# EAGLE schematic dpad (EAGLE 6.6.0)
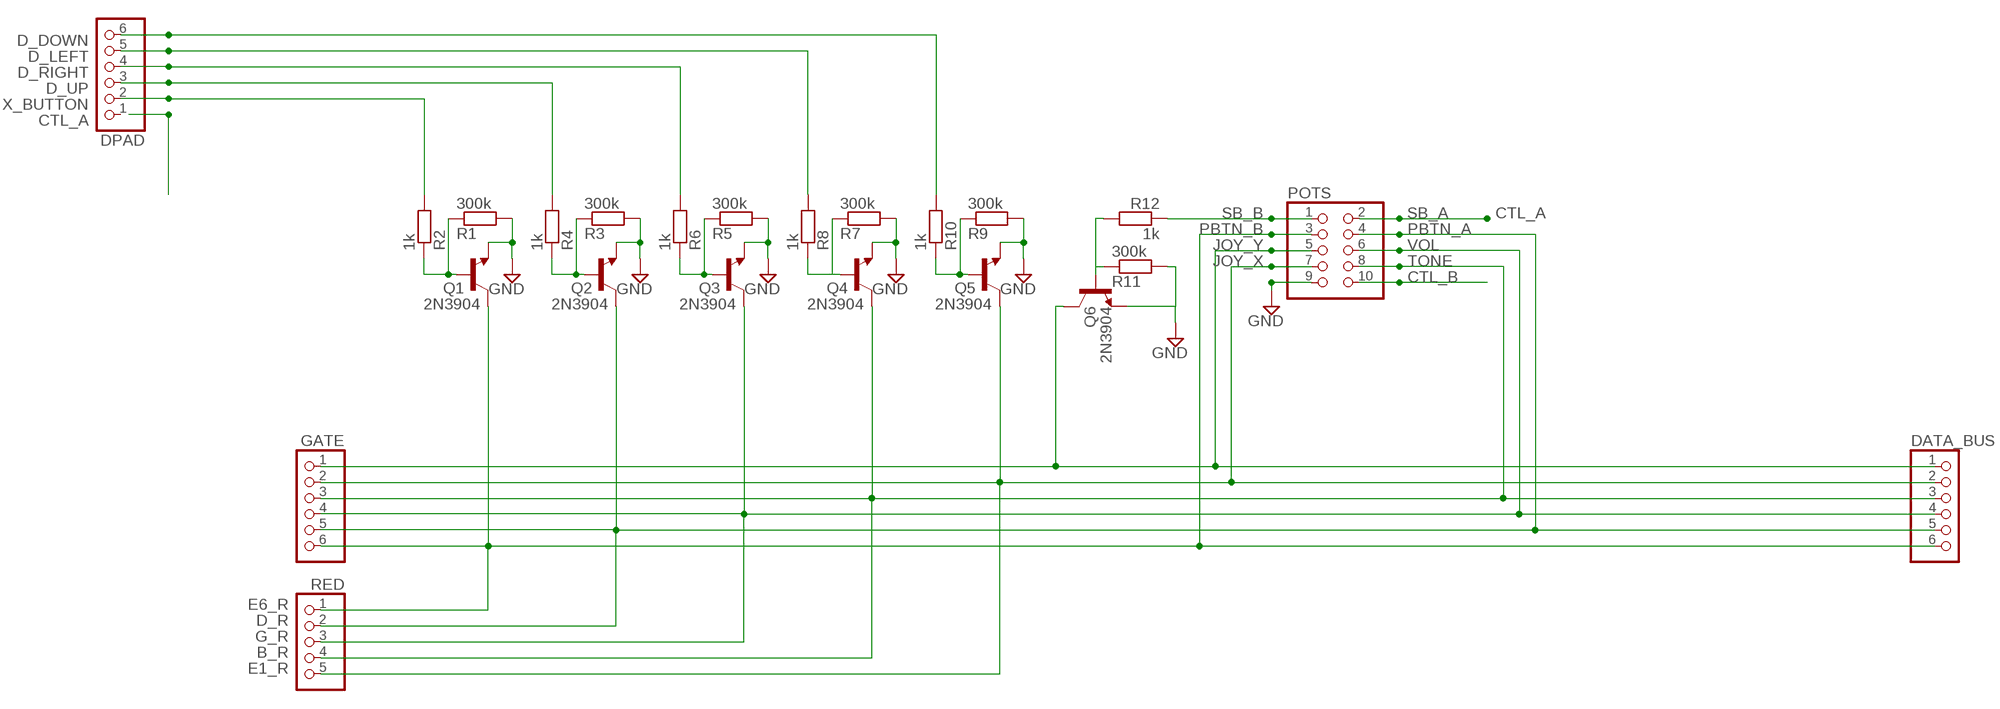
[diagram p0: schematic, sheet 1]

## Parts
DATA_BUS  PINHD-1X6  [1X06]
DPAD  PINHD-1X6  [1X06]
GATE  PINHD-1X6  [1X06]
POTS  PINHD-2X5  [2X05]
Q1  2N3904  [TO92-]
Q2  2N3904  [TO92-]
Q3  2N3904  [TO92-]
Q4  2N3904  [TO92-]
Q5  2N3904  [TO92-]
Q6  2N3904  [TO92-]
R1  300k  6MM-EU1  [R0207/1V]
R2  1k  6MM-EU1  [R0207/1V]
R3  300k  6MM-EU1  [R0207/1V]
R4  1k  6MM-EU1  [R0207/1V]
R5  300k  6MM-EU1  [R0207/1V]
R6  1k  6MM-EU1  [R0207/1V]
R7  300k  6MM-EU1  [R0207/1V]
R8  1k  6MM-EU1  [R0207/1V]
R9  300k  6MM-EU1  [R0207/1V]
R10  1k  6MM-EU1  [R0207/1V]
R11  300k  6MM-EU1  [R0207/1V]
R12  1k  6MM-EU1  [R0207/1V]
RED  PINHD-1X5  [1X05]

## Nets
CTL_A: POTS.2
D_DOWN: DPAD.6 R10.2
D_LEFT: DPAD.5 R8.2
D_RIGHT: DPAD.4 R6.2
D_UP: DPAD.3 R4.2
GND: POTS.9 Q1.3(E) Q2.3(E) Q3.3(E) Q4.3(E) Q5.3(E) Q6.3(E) R1.2 R3.2 R5.2 R7.2 R9.2 R11.2
N$1: Q2.2(B) R3.1 R4.1
N$2: Q3.2(B) R5.1 R6.1
N$3: Q4.2(B) R7.1 R8.1
N$4: Q5.2(B) R9.1 R10.1
N$5: Q6.2(B) R11.1 R12.2
N$6: POTS.10
N$7: DATA_BUS.3 GATE.3 POTS.8 Q4.1(C) RED.4
N$8: Q1.2(B) R1.1 R2.1
N$9: DATA_BUS.4 GATE.4 POTS.6 Q3.1(C) RED.3
N$10: DATA_BUS.5 GATE.5 POTS.4 Q2.1(C) RED.2
N$14: DATA_BUS.6 GATE.6 POTS.3 Q1.1(C) RED.1
N$17: DATA_BUS.1 GATE.1 POTS.5 Q6.1(C)
N$18: DATA_BUS.2 GATE.2 POTS.7 Q5.1(C) RED.5
SB_2: POTS.1 R12.1
X_BUTTON: DPAD.2 R2.2
Unconnected: DPAD.1

## Notes on the sheet
- CTL_A
- SB_B | SB_A
- PBTN_B | PBTN_A
- JOY_Y | VOL
- JOY_X | TONE
- CTL_B
- E6_R
- D_R
- G_R
- B_R
- E1_R

## Library data of the parts
DATA_BUS DPAD GATE = pinhead:PINHD-1X6: PIN HEADER
POTS = pinhead:PINHD-2X5: PIN HEADER
Q1-Q6 = gm-trans:2N3904: NPN Transistor
R1-R12 = gm-resistors:6MM-EU: 6mm Resistors (European schematic symbol) Leads spaced 1-6 holes apart for 0.1" perfboard. Suitable for 1/4 watt resistors.
RED = pinhead:PINHD-1X5: PIN HEADER